# Altium schematic sheet TOP.SchDoc: LED Matrix
size A4; Author: Bencsik Dániel Zoltán; Organization: BME-AUT; DocumentNumber: 1; Revision: R7; SheetNumber: 1; SheetTotal: 4
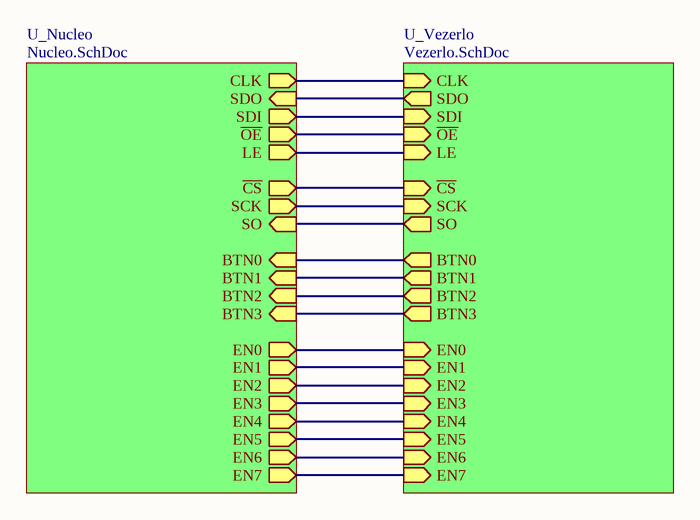
[diagram p0: TOP.SchDoc]

## Sub-sheets
U_Nucleo = Nucleo.SchDoc: EN1 (out), EN2 (out), EN3 (out), EN4 (out), EN5 (out), EN6 (out), EN7 (out), EN0 (out), SDI (out), CLK (out), LE (out), ~{OE} (out), SDO (in), ~{CS} (out), SCK (out), SO (in), BTN0 (in), BTN1 (in), BTN2 (in), BTN3 (in)
U_Vezerlo = Vezerlo.SchDoc: SDI (in), CLK (in), LE (in), ~{OE} (in), EN0 (in), EN1 (in), EN2 (in), EN3 (in), EN4 (in), EN5 (in), EN6 (in), EN7 (in), SDO (out), ~{CS} (in), SCK (in), SO (out), BTN0 (out), BTN1 (out), BTN2 (out), BTN3 (out)

## Nets
(unnamed): sheet U_Nucleo/EN1, sheet U_Vezerlo/EN1
(unnamed): sheet U_Nucleo/EN2, sheet U_Vezerlo/EN2
(unnamed): sheet U_Nucleo/EN3, sheet U_Vezerlo/EN3
(unnamed): sheet U_Nucleo/EN4, sheet U_Vezerlo/EN4
(unnamed): sheet U_Nucleo/EN5, sheet U_Vezerlo/EN5
(unnamed): sheet U_Nucleo/EN6, sheet U_Vezerlo/EN6
(unnamed): sheet U_Nucleo/EN7, sheet U_Vezerlo/EN7
(unnamed): sheet U_Nucleo/EN0, sheet U_Vezerlo/EN0
(unnamed): sheet U_Nucleo/SDI, sheet U_Vezerlo/SDI
(unnamed): sheet U_Nucleo/CLK, sheet U_Vezerlo/CLK
(unnamed): sheet U_Nucleo/LE, sheet U_Vezerlo/LE
(unnamed): sheet U_Nucleo/~{OE}, sheet U_Vezerlo/~{OE}
(unnamed): sheet U_Nucleo/SDO, sheet U_Vezerlo/SDO
(unnamed): sheet U_Nucleo/~{CS}, sheet U_Vezerlo/~{CS}
(unnamed): sheet U_Nucleo/SCK, sheet U_Vezerlo/SCK
(unnamed): sheet U_Nucleo/SO, sheet U_Vezerlo/SO
(unnamed): sheet U_Nucleo/BTN0, sheet U_Vezerlo/BTN0
(unnamed): sheet U_Nucleo/BTN1, sheet U_Vezerlo/BTN1
(unnamed): sheet U_Nucleo/BTN2, sheet U_Vezerlo/BTN2
(unnamed): sheet U_Nucleo/BTN3, sheet U_Vezerlo/BTN3

## Notes on the sheet
- Title
- Size:
- Date:
- A4
- Number:
- Time:
- Revision:
- Sheet
- of
- File: